# Altium schematic sheet Ultrasonic.SchDoc
size A
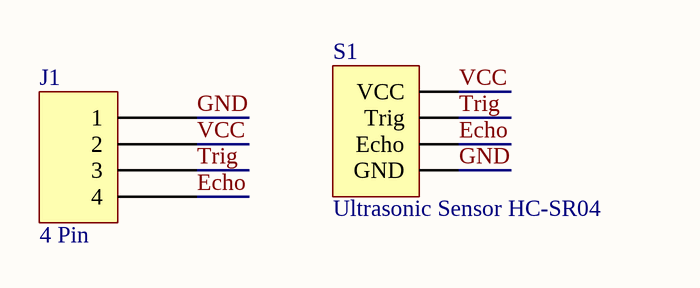
[diagram p0: Ultrasonic.SchDoc]

## Parts
J1  4 Pin  [JST XH B4B-XH-A - RIGHT]
S1  Ultrasonic Sensor HC-SR04  [Ultrasonic]

## Nets
Echo: J1.4 S1.3(Echo)
GND: J1.1 S1.4(GND)
Trig: J1.3 S1.2(Trig)
VCC: J1.2 S1.1(VCC)